# EAGLE design zb_pt4115_v1.1 (EAGLE 9.6.2)
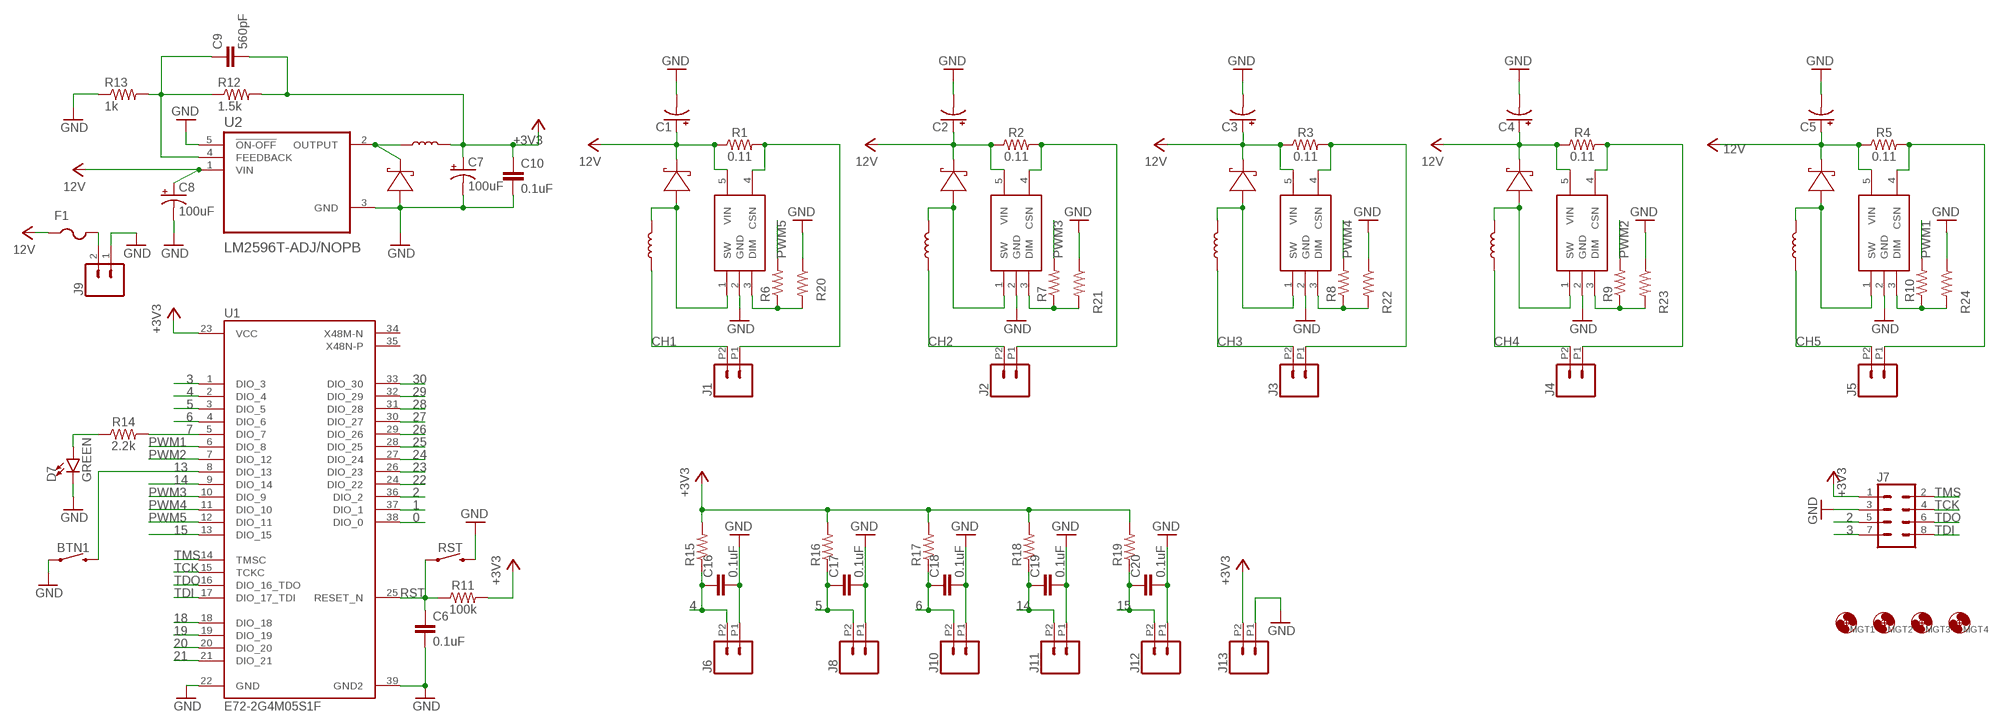
[diagram p0: schematic, sheet 1]

## Parts
BTN1  MOMENTARY-SWITCH-SPST-SMD-4.6X2.8MM  [TACTILE_SWITCH_SMD_4.6X2.8MM]
C1  100uF  100UF-POLAR-EIA7343-16V-10%(TANT)  [EIA7343]
C2  100uF  100UF-POLAR-EIA7343-16V-10%(TANT)  [EIA7343]
C3  100uF  100UF-POLAR-EIA7343-16V-10%(TANT)  [EIA7343]
C4  100uF  100UF-POLAR-EIA7343-16V-10%(TANT)  [EIA7343]
C5  100uF  100UF-POLAR-EIA7343-16V-10%(TANT)  [EIA7343]
C6  0.1uF  0.1UF-0603-100V-10%  [0603]
C7  100uF  100UF-POLAR-25V-20%(ELEC)  [PANASONIC_D]
C8  100uF  100UF-POLAR-25V-20%(ELEC)  [PANASONIC_D]
C9  560pF  560PF-0603-50V-5%  [0603]
C10  0.1uF  0.1UF-0603-25V-5%  [0603]
C16  0.1uF  0.1UF-0603-100V-10%  [0603]
C17  0.1uF  0.1UF-0603-100V-10%  [0603]
C18  0.1uF  0.1UF-0603-100V-10%  [0603]
C19  0.1uF  0.1UF-0603-100V-10%  [0603]
C20  0.1uF  0.1UF-0603-100V-10%  [0603]
D1  SS18  [DIOM5227X270N]
D2  SS18  [DIOM5227X270N]
D3  SS18  [DIOM5227X270N]
D4  SS18  [DIOM5227X270N]
D5  SS18  [DIOM5227X270N]
D6  SS18  [DIOM5227X270N]
D7  GREEN  LED-GREEN0603  [LED-0603]
F1  PTCFUSE-1812  [1812]
IC1  68uH  MSS1038-473MLB  [INDPM102100X400N]
IC2  68uH  MSS1038-473MLB  [INDPM102100X400N]
IC3  68uH  MSS1038-473MLB  [INDPM102100X400N]
IC4  68uH  MSS1038-473MLB  [INDPM102100X400N]
IC5  68uH  MSS1038-473MLB  [INDPM102100X400N]
IC6  68uH  MSS1038-473MLB  [INDPM102100X400N]
J1  CONN_022.54MM_SCREWTERM  [1X02_2.54_SCREWTERM]
J2  CONN_022.54MM_SCREWTERM  [1X02_2.54_SCREWTERM]
J3  CONN_022.54MM_SCREWTERM  [1X02_2.54_SCREWTERM]
J4  CONN_022.54MM_SCREWTERM  [1X02_2.54_SCREWTERM]
J5  CONN_022.54MM_SCREWTERM  [1X02_2.54_SCREWTERM]
J6  CONN_022.54MM_SCREWTERM  [1X02_2.54_SCREWTERM]
J7  CONN_04X2  [2X4]
J8  CONN_022.54MM_SCREWTERM  [1X02_2.54_SCREWTERM]
J9  CONN_025MM  [SCREWTERMINAL-5MM-2]
J10  CONN_022.54MM_SCREWTERM  [1X02_2.54_SCREWTERM]
J11  CONN_022.54MM_SCREWTERM  [1X02_2.54_SCREWTERM]
J12  CONN_022.54MM_SCREWTERM  [1X02_2.54_SCREWTERM]
J13  CONN_022.54MM_SCREWTERM  [1X02_2.54_SCREWTERM]
MGT1  MOUNT-HOLE3.0  [3,0]
MGT2  MOUNT-HOLE3.0  [3,0]
MGT3  MOUNT-HOLE3.0  [3,0]
MGT4  MOUNT-HOLE3.0  [3,0]
R1  0.11  0.11OHM-2010-1/2W-1%  [2010]
R2  0.11  0.11OHM-2010-1/2W-1%  [2010]
R3  0.11  0.11OHM-2010-1/2W-1%  [2010]
R4  0.11  0.11OHM-2010-1/2W-1%  [2010]
R5  0.11  0.11OHM-2010-1/2W-1%  [2010]
R6  100Ohm  R-US_R0805  [R0805]
R7  100Ohm  R-US_R0805  [R0805]
R8  100Ohm  R-US_R0805  [R0805]
R9  100Ohm  R-US_R0805  [R0805]
R10  100Ohm  R-US_R0805  [R0805]
R11  100k  100KOHM-0603-1/10W-1%  [0603]
R12  1.5k  R-US_R0805  [R0805]
R13  1k  R-US_R0805  [R0805]
R14  2.2k  2.2KOHM-0603-1/10W-1%  [0603]
R15  10k  R-US_R0805  [R0805]
R16  10k  R-US_R0805  [R0805]
R17  10k  R-US_R0805  [R0805]
R18  10k  R-US_R0805  [R0805]
R19  10k  R-US_R0805  [R0805]
R20  3k  R-US_R0805  [R0805]
R21  3k  R-US_R0805  [R0805]
R22  3k  R-US_R0805  [R0805]
R23  3k  R-US_R0805  [R0805]
R24  3k  R-US_R0805  [R0805]
RST  MOMENTARY-SWITCH-SPST-SMD-4.6X2.8MM  [TACTILE_SWITCH_SMD_4.6X2.8MM]
U1  E72-2G4M05S1F  [E72-2G4M05S1F]
U2  LM2596T-ADJ/NOPB  [TO170P1016X470X2092-5]
U$1  PT4115  [SOT-89-5]
U$2  PT4115  [SOT-89-5]
U$3  PT4115  [SOT-89-5]
U$4  PT4115  [SOT-89-5]
U$5  PT4115  [SOT-89-5]

## Nets
0: U1.38(DIO_0)
1: U1.37(DIO_1)
2: J7.5 U1.36(DIO_2)
3: J7.7 U1.1(DIO_3)
4: C16.1 J6.P2 R15.1 U1.2(DIO_4)
5: C17.1 J8.P2 R16.1 U1.3(DIO_5)
6: C18.1 J10.P2 R17.1 U1.4(DIO_6)
7: R14.2 U1.5(DIO_7)
13: BTN1.3 BTN1.4 U1.8(DIO_13)
14: C19.1 J11.P2 R18.1 U1.9(DIO_14)
15: C20.1 J12.P2 R19.1 U1.13(DIO_15)
18: U1.18(DIO_18)
19: U1.19(DIO_19)
20: U1.20(DIO_20)
21: U1.21(DIO_21)
22: U1.24(DIO_22)
23: U1.26(DIO_23)
24: U1.27(DIO_24)
25: U1.28(DIO_25)
26: U1.29(DIO_26)
27: U1.30(DIO_27)
28: U1.31(DIO_28)
29: U1.32(DIO_29)
30: U1.33(DIO_30)
+3V3: C7.+ C9.2 C10.1 IC6.2 J7.1 J13.P2 R11.2 R12.2 R15.2 R16.2 R17.2 R18.2 R19.2 U1.23(VCC)
CH1: IC1.1 J1.P2
CH2: IC2.1 J2.P2
CH3: IC3.1 J3.P2
CH4: IC4.1 J4.P2
CH5: IC5.1 J5.P2
GND: BTN1.1 BTN1.2 C1.C(-) C2.C(-) C3.C(-) C4.C(-) C5.C(-) C6.2 C7.- C8.- C10.2 C16.2 C17.2 C18.2 C19.2 C20.2 D6.2(A) D7.C J6.P1 J7.3 J8.P1 J9.1 J10.P1 J11.P1 J12.P1 J13.P1 R13.1 R20.1 R21.1 R22.1 R23.1 R24.1 RST.3 RST.4 U1.22(GND) U1.39(GND2) U2.3(GND) U2.5(!ON-OFF) U$1.2(GND) U$2.2(GND) U$3.2(GND) U$4.2(GND) U$5.2(GND)
N$1: D1.2(A) IC1.2 U$1.1(SW)
N$2: R6.1 R20.2 U$1.3(DIM)
N$3: C9.1 R12.1 R13.2 U2.4(FEEDBACK)
N$4: D2.2(A) IC2.2 U$2.1(SW)
N$5: J1.P1 R1.2 U$1.4(CSN)
N$6: J2.P1 R2.2 U$2.4(CSN)
N$7: R7.1 R21.2 U$2.3(DIM)
N$8: R8.1 R22.2 U$3.3(DIM)
N$9: D3.2(A) IC3.2 U$3.1(SW)
N$10: J3.P1 R3.2 U$3.4(CSN)
N$11: R9.1 R23.2 U$4.3(DIM)
N$12: R10.1 R24.2 U$5.3(DIM)
N$13: D4.2(A) IC4.2 U$4.1(SW)
N$14: J4.P1 R4.2 U$4.4(CSN)
N$15: D7.A R14.1
N$16: D6.1(K) IC6.1 U2.2(OUTPUT)
N$17: D5.2(A) IC5.2 U$5.1(SW)
N$18: J5.P1 R5.2 U$5.4(CSN)
PWM1: R10.2 U1.6(DIO_8)
PWM2: R9.2 U1.7(DIO_12)
PWM3: R7.2 U1.10(DIO_9)
PWM4: R8.2 U1.11(DIO_10)
PWM5: R6.2 U1.12(DIO_11)
RST: C6.1 R11.1 RST.1 RST.2 U1.25(RESET_N)
TCK: J7.4 U1.15(TCKC)
TDI: J7.8 U1.17(DIO_17_TDI)
TDO: J7.6 U1.16(DIO_16_TDO)
TMS: J7.2 U1.14(TMSC)
VCC: C1.A(+) C2.A(+) C3.A(+) C4.A(+) C5.A(+) C8.+ D1.1(K) D2.1(K) D3.1(K) D4.1(K) D5.1(K) F1.1 F1.2 J9.2 R1.1 R2.1 R3.1 R4.1 R5.1 U2.1(VIN) U$1.5(VIN) U$2.5(VIN) U$3.5(VIN) U$4.5(VIN) U$5.5(VIN) ; supply symbol labelled 12V
Unconnected: U1.34(X48M-N) U1.35(X48N-P)

## Library data of the parts
BTN1 RST = SparkFun-Switches:MOMENTARY-SWITCH-SPST: Momentary Switch (Pushbutton) - SPST Normally-open (NO) SPST momentary switches (buttons, pushbuttons). Variants PTH-12MM - 12mm square, through-hole Momentary Pushbutton Switch - 12mm Square <https://www.sparkfun.com/products/9190> (COM-09190) PTH-6.0MM, PTH-6.0MM-KIT - 6.0mm square, through-hole Mini Pushbutton Switch <https://www.sparkfun.com/products/97> (COM-00097) KIT package intended for soldering kit's - only one side of pads' copper is exposed. PTH-RIGHT-ANGLE-KIT - Right-angle, through-hole Right Angle Tactile Button <https://www.sparkfun.com/products/10791> - Used on SparkFun BigTime Watch Kit <https://www.sparkfun.com/products/11734> SMD-12MM - 12mm square, surface-mount Tactile Button - SMD (12mm) <https://www.sparkfun.com/products/12993> (COM-12993) Used on SparkFun PicoBoard <https://www.sparkfun.com/products/11888> SMD-4.5MM - 4.5mm Square Trackball Switch Used on SparkFun Blackberry Trackballer Breakout <https://www.sparkfun.com/products/13169> SMD-4.6MMX2.8MM - 4.60mm x 2.80mm, surface mount Used on SparkFun SAMD21 Mini Breakout <https://www.sparkfun.com/products/13664> SMD-5.2MM, SMD-5.2-REDUNDANT - 5.2mm square, surface-mount Mini Pushbutton Switch - SMD <https://www.sparkfun.com/products/8720> (COM-08720) Used on Arduino Pro Mini <https://www.sparkfun.com/products/11114> REDUNDANT package connects both switch circuits together SMD-6.0X3.5MM - 6.0 x 3.5mm, surface mount Momentary Reset Switch SMD <https://www.sparkfun.com/products/8229> (COM-08229) SMD-6.2MM-TALL - 6.2mm square, surface mount Tactile Button - SMD (6mm) <https://www.sparkfun.com/products/12992> Used on SparkFun Digital Sandbox <https://www.sparkfun.com/products/12651> SMD-RIGHT-ANGLE - Right-angle, surface mount Used on SparkFun Block for Intel® Edison - Arduino <https://www.sparkfun.com/products/13036>; PROD_ID: SWCH-13065
C1-C5 = SparkFun-Capacitors:100UF-POLAR: 100µF polarized capacitors A capacitor is a passive two-terminal electrical component used to store electrical energy temporarily in an electric field.; PROD_ID: CAP-08702
C6 C16-C20 = SparkFun-Capacitors:0.1UF: 0.1µF ceramic capacitors A capacitor is a passive two-terminal electrical component used to store electrical energy temporarily in an electric field.; PROD_ID: CAP-08390
C7 C8 = SparkFun-Capacitors:100UF-POLAR: 100µF polarized capacitors A capacitor is a passive two-terminal electrical component used to store electrical energy temporarily in an electric field.; PROD_ID: CAP-12547
C9 = SparkFun-Capacitors:560PF: 0.56nF/560pF ceramic capacitors A capacitor is a passive two-terminal electrical component used to store electrical energy temporarily in an electric field.; PROD_ID: CAP-08749
C10 = SparkFun-Capacitors:0.1UF: 0.1µF ceramic capacitors A capacitor is a passive two-terminal electrical component used to store electrical energy temporarily in an electric field.; PROD_ID: CAP-08604
D1-D6 = SS18:SS18: Schottky Diodes & Rectifiers 1a 80V Rectifier Schottky Barrier Source: Datasheet <https://componentsearchengine.com/Datasheets/2/SS18.pdf>; ARROW_PART_NUMBER: SS18; ARROW_PRICE-STOCK: https://www.arrow.com/en/products/ss18/on-semiconductor?region=nac; DESCRIPTION: Schottky Diodes & Rectifiers 1a 80V Rectifier Schottky Barrier; HEIGHT: 2.7mm; MANUFACTURER_NAME: ON Semiconductor; MANUFACTURER_PART_NUMBER: SS18; MOUSER_PART_NUMBER: 512-SS18; MOUSER_PRICE-STOCK: https://www.mouser.co.uk/ProductDetail/ON-Semiconductor-Fairchild/SS18?qs=mVVXn4M53U%252B25aMJheuSLA%3D%3D
D7 = SparkFun-LED:LED-GREEN: Green SMD LED Used in manufacturing of various products at SparkFun Packages: 0603 - SMD 0603 package [Product Link] <http://www.futureelectronics.com/en/technologies/semiconductors/optoelectronics/leds/Pages/9894312-LTST-C190GKT.aspx?CrossPart=HSMG-C190&IM=0> LilyPad 1206 - SMD1206 LilyPad package [Product Link] <http://www.futureelectronics.com/en/Technologies/Product.aspx?ProductID=IN150NGHARVATEKCORPORATION2049943&IM=0> 1206 - SMD1206 package [Product Link] <http://www.futureelectronics.com/en/technologies/semiconductors/optoelectronics/leds/Pages/8315665-LTST-C150KGKT.aspx?IM=0> 1206 Bottom Mount -SMD 1206 Bottom Mount [Product Link] <http://www.digikey.com/product-detail/en/lite-on-inc/LTST-C230KGKT/160-1456-1-ND/386854> SparkFun Products: Pro Mini 328 -5V <https://www.sparkfun.com/products/821> RedBoard <https://www.sparkfun.com/products/12757> MP3 Trigger <https://www.sparkfun.com/products/13720> Makey Makey <https://www.sparkfun.com/products/11076>; PROD_ID: DIO-00821
F1 = adafruit:PTCFUSE: PTC fuses, resettable thermistors
IC1-IC6 = MSS1038-473MLB:MSS1038-473MLB: Fixed Inductors MSS1038 SMT Shielded 47 uH 20 % 2.2 A Source: Datasheet <https://componentsearchengine.com/Datasheets/1/MSS1038-473MLB.pdf>; DESCRIPTION: Fixed Inductors MSS1038 SMT Shielded 47 uH 20 % 2.2 A; HEIGHT: 4mm; MANUFACTURER_NAME: COILCRAFT; MANUFACTURER_PART_NUMBER: MSS1038-473MLB; MOUSER_PART_NUMBER: 994-MSS1038-473MLB; MOUSER_PRICE-STOCK: https://www.mouser.co.uk/ProductDetail/Coilcraft/MSS1038-473MLB/?qs=VJjuEbE9QBN6EsaT8NREzg%3D%3D
J1-J6 J8 J10-J13 = SparkFun-Connectors:CONN_02: Multi connection point. Often used as Generic Header-pin footprint for 0.1 inch spaced/style header connections On any of the 0.1 inch spaced packages, you can populate with these: Break Away Headers - Straight <https://www.sparkfun.com/products/116> (PRT-00116) Break Away Male Headers - Right Angle <https://www.sparkfun.com/products/553> (PRT-00553) Female Headers <https://www.sparkfun.com/products/115> (PRT-00115) Break Away Headers - Machine Pin <https://www.sparkfun.com/products/117> (PRT-00117) Break Away Female Headers - Swiss Machine Pin <https://www.sparkfun.com/products/743> (PRT-00743) For SCREWTERMINALS and SPRING TERMINALS visit here: Screw Terimnals on SparkFun.com <https://www.sparkfun.com/search/results?term=Screw+Terminals> (5mm/3.5mm/2.54mm spacing) This device is also useful as a general connection point to wire up your design to another part of your project. Our various solder wires solder well into these plated through hole pads. Hook-Up Wire - Assortment (Stranded, 22 AWG) <https://www.sparkfun.com/products/11375> (PRT-11375) Hook-Up Wire - Assortment (Solid Core, 22 AWG) <https://www.sparkfun.com/products/11367> (PRT-11367) View the entire wire category on our website here <https://www.sparkfun.com/categories/141> Special notes: Molex polarized connector foot print use with: PRT-08233 with associated crimp pins and housings. 2.54_SCREWTERM for use with PRT-10571. 3.5mm Screw Terminal footprints for PRT-08084 5mm Screw Terminal footprints for use with PRT-08432
J7 = SparkFun-SEWPAD16:CONN_04X2: Multi connection point. Often used as Generic Header-pin footprint for 0.1 inch spaced/style header connections On any of the 0.1 inch spaced packages, you can populate with these: Break Away Headers - Straight <https://www.sparkfun.com/products/116> (PRT-00116) Break Away Male Headers - Right Angle <https://www.sparkfun.com/products/553> (PRT-00553) Female Headers <https://www.sparkfun.com/products/115> (PRT-00115) Break Away Headers - Machine Pin <https://www.sparkfun.com/products/117> (PRT-00117) Break Away Female Headers - Swiss Machine Pin <https://www.sparkfun.com/products/743> (PRT-00743)
J9 = SparkFun-SEWPAD16:CONN_02: Multi connection point. Often used as Generic Header-pin footprint for 0.1 inch spaced/style header connections On any of the 0.1 inch spaced packages, you can populate with these: Break Away Headers - Straight <https://www.sparkfun.com/products/116> (PRT-00116) Break Away Male Headers - Right Angle <https://www.sparkfun.com/products/553> (PRT-00553) Female Headers <https://www.sparkfun.com/products/115> (PRT-00115) Break Away Headers - Machine Pin <https://www.sparkfun.com/products/117> (PRT-00117) Break Away Female Headers - Swiss Machine Pin <https://www.sparkfun.com/products/743> (PRT-00743) For SCREWTERMINALS and SPRING TERMINALS visit here: Screw Terimnals on SparkFun.com <https://www.sparkfun.com/search/results?term=Screw+Terminals> (5mm/3.5mm/2.54mm spacing) This device is also useful as a general connection point to wire up your design to another part of your project. Our various solder wires solder well into these plated through hole pads. Hook-Up Wire - Assortment (Stranded, 22 AWG) <https://www.sparkfun.com/products/11375> (PRT-11375) Hook-Up Wire - Assortment (Solid Core, 22 AWG) <https://www.sparkfun.com/products/11367> (PRT-11367) View the entire wire category on our website here <https://www.sparkfun.com/categories/141> Special notes: Molex polarized connector foot print use with: PRT-08233 with associated crimp pins and housings. 2.54_SCREWTERM for use with PRT-10571. 3.5mm Screw Terminal footprints for PRT-08084 5mm Screw Terminal footprints for use with PRT-08432; SF_SKU: PRT-08432
MGT1-MGT4 = holes:MOUNT-HOLE: MOUNTING HOLE with drill center marker
R1-R5 = SparkFun-Resistors:0.11OHM: 0.11Ω resistor A resistor is a passive two-terminal electrical component that implements electrical resistance as a circuit element. Resistors act to reduce current flow, and, at the same time, act to lower voltage levels within circuits. - Wikipedia; PROD_ID: RES-08354
R6-R10 R12 R13 R15-R24 = adafruit:R-US_: RESISTOR, American symbol
R11 = SparkFun-Resistors:100KOHM: 100kΩ resistor A resistor is a passive two-terminal electrical component that implements electrical resistance as a circuit element. Resistors act to reduce current flow, and, at the same time, act to lower voltage levels within circuits. - Wikipedia; PROD_ID: RES-07828
R14 = SparkFun-Resistors:2.2KOHM: 2.2kΩ resistor A resistor is a passive two-terminal electrical component that implements electrical resistance as a circuit element. Resistors act to reduce current flow, and, at the same time, act to lower voltage levels within circuits. - Wikipedia; PROD_ID: RES-08272
U1 = E72-2G4M05S1F:E72-2G4M05S1F
U2 = LM2596T-ADJ_NOPB:LM2596T-ADJ/NOPB: Check prices <https://pricing.snapeda.com/parts/LM2596T-ADJ/NOPB/Texas%20Instruments/view-part?ref=eda>; AVAILABILITY: In Stock; DESCRIPTION: SIMPLE SWITCHER&reg; 4.5V to 40V, 3A Low Component Count Step-Down Regulator 5-TO-220 -40 to 125; MF: Texas Instruments; MP: LM2596T-ADJ/NOPB; PACKAGE: TO-220-5 Texas Instruments; PRICE: None; PURCHASE-URL: https://pricing.snapeda.com/search/part/LM2596T-ADJ/NOPB/?ref=eda
U$1-U$5 = PT4115:PT4115: 30V, 1.2A Step-down HIgh Brightness LED Driver with 5000:1 Dimming Check prices <https://pricing.snapeda.com/parts/PT4115/Pulse/view-part?ref=eda>; AVAILABILITY: Not in stock; MF: Pulse; MP: PT4115; PACKAGE: None; PRICE: None

## Board
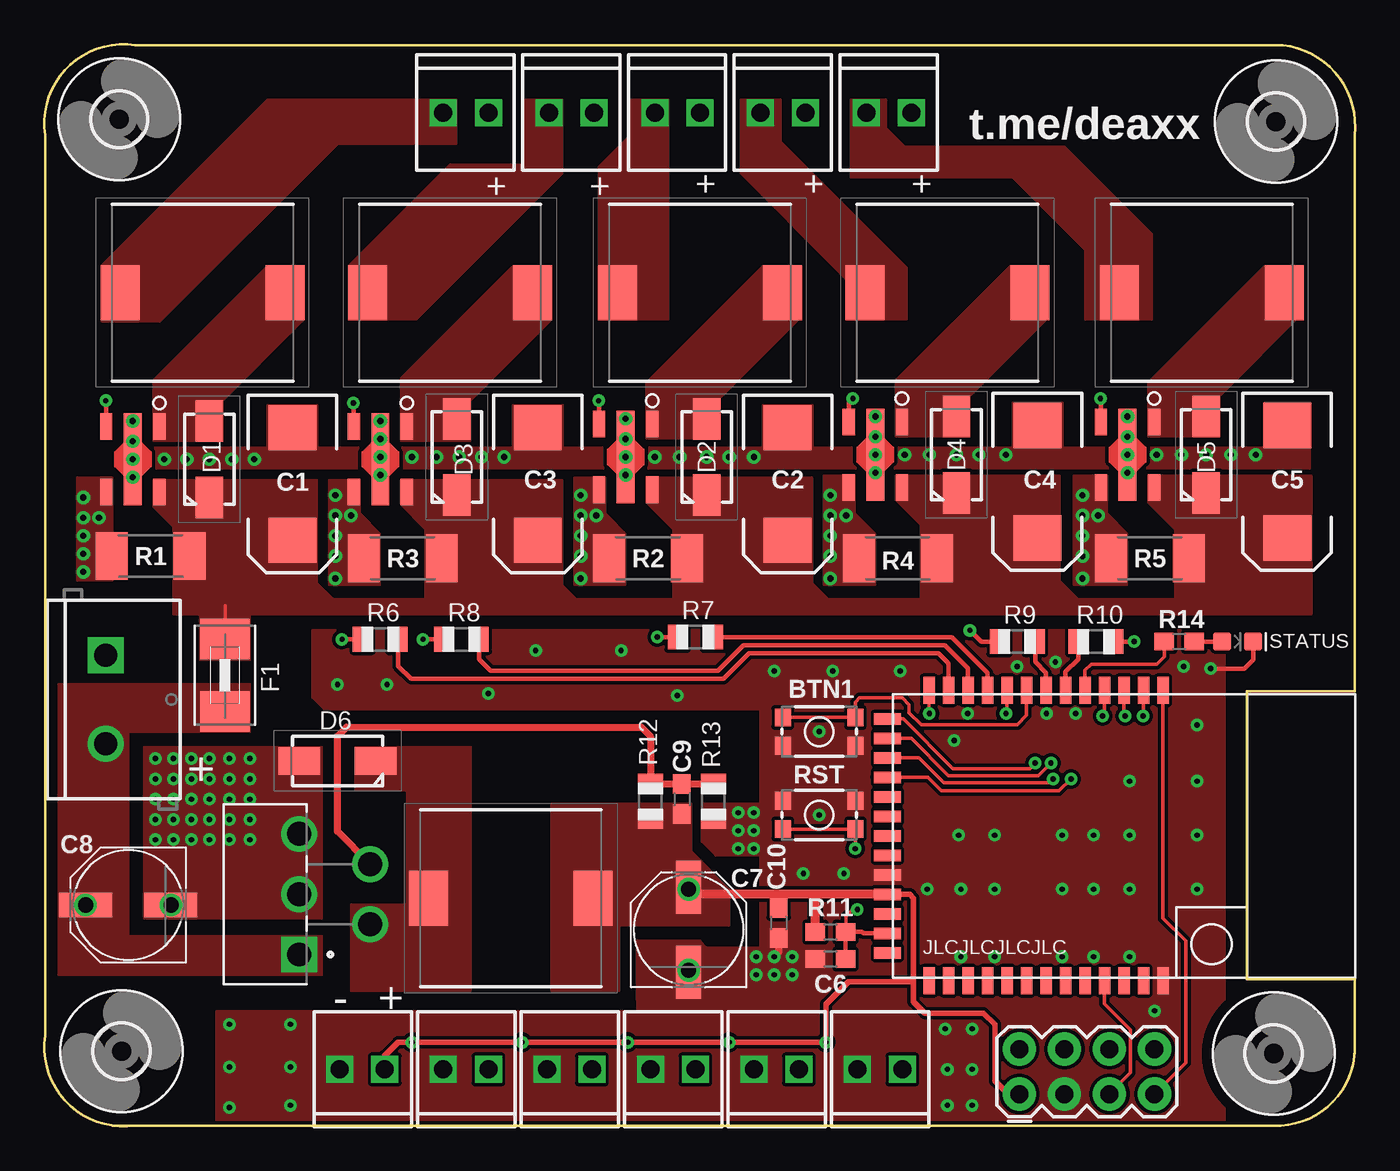
[diagram p1: board, top side]
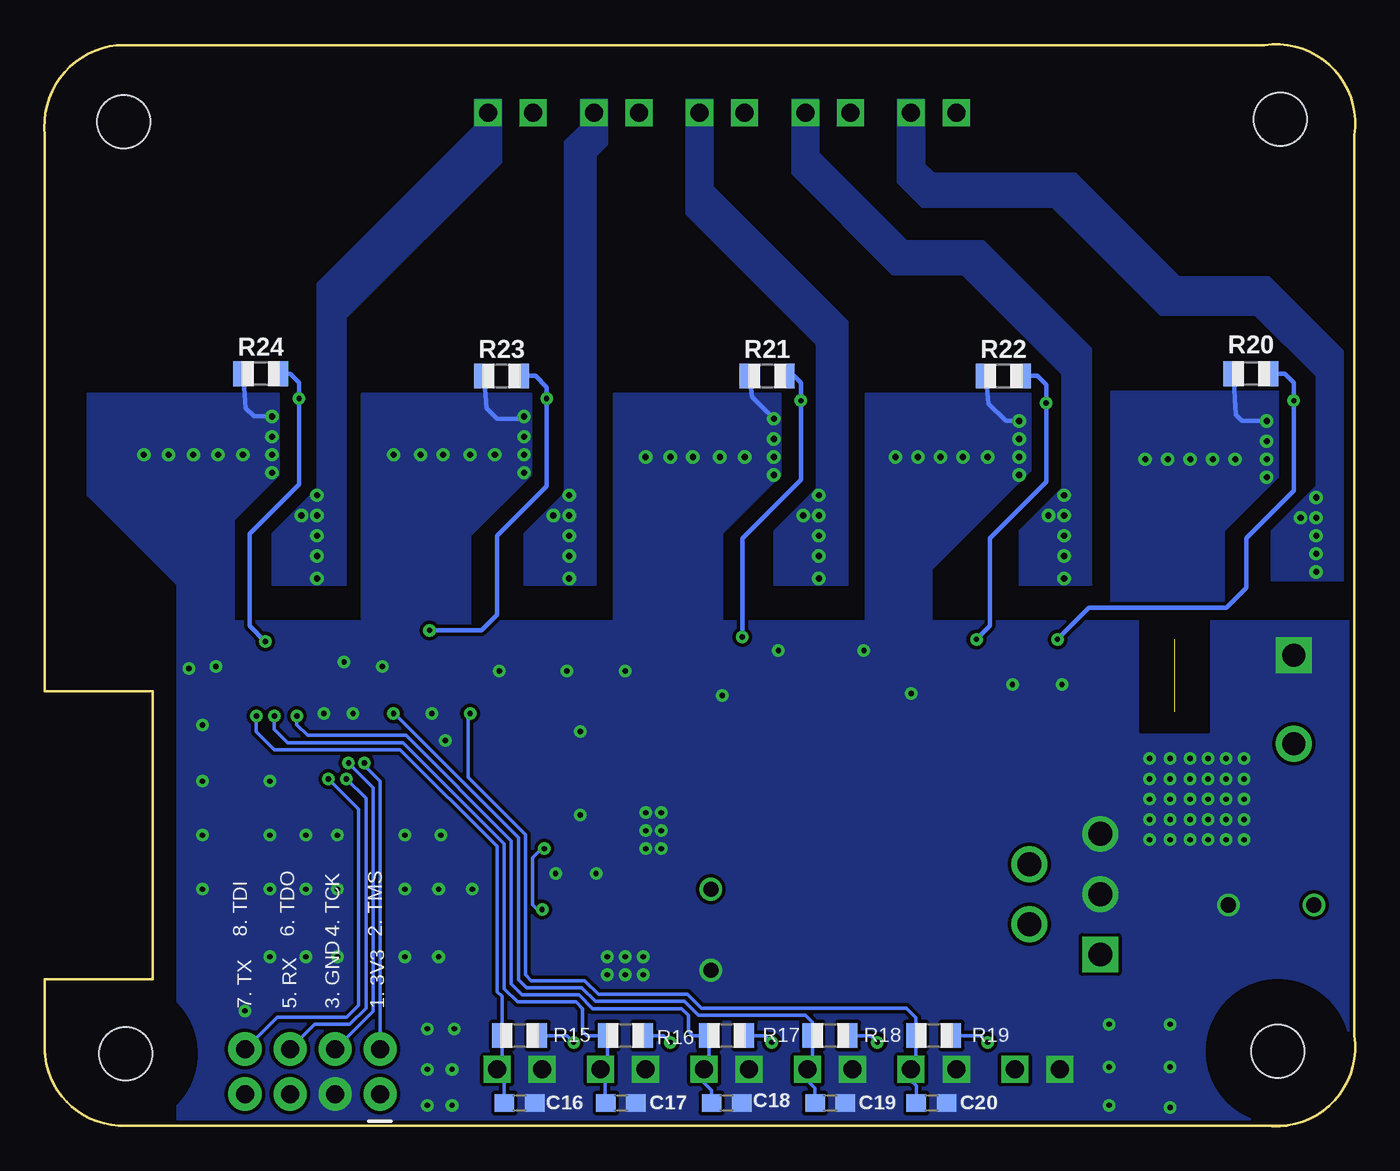
[diagram p2: board, bottom side, seen from below]

Size 73.98 x 61.04 mm. Coordinates in mm from the lower left corner, seen from the top.
Outline: 5.12,0.04 3.85,0.04
Outline: 5.12,0.04 arc-106 0.04,5.12 0.04,55.92 arc-106 5.12,61 69.89,61 arc-90 73.95,55.92 73.95,24.55 67.86,24.55 67.86,8.3 73.95,8.3 73.95,4.36
Outline: 5.12,0.04 69.38,0.04
Outline: 69.38,0.04 69.76,0.04
Outline: 73.95,4.36 73.95,4.1
Outline: 73.95,4.36 arc-92 69.38,0.04
Copper layers (1*16): Top 0.035mm / dielectric 1.5mm / Bottom 0.035mm
Design rules "default *": minimum track width 0.2mm, minimum drill 0.2mm, track to track 0.2mm, track to pad 6mil, pad to pad 6mil, via to via 6mil, smd to smd 6mil, copper to edge 0.2mm, drill to drill 0.3mm, minimum pad ring 10mil, minimum via ring 8mil, stop-mask expansion 4mil, vias tented up to drill 0.35mm, thermal gap 10mil
bRestrict: area 8.3,22.3 to 12.1,28.6

### Footprints (pad centres in the part's own frame; a part is rotated, then mirrored left to right if it is on the bottom)
TACTILE_SWITCH_SMD_4.6X2.8MM = smd 0.9 x 1: 1 -2.05,-0.8; 2 2.05,-0.8; 3 2.05,0.8; 4 -2.05,0.8
EIA7343 = smd 2.55 x 2.7: A 3.17,0; C -3.17,0
0603 = smd 1.1 x 1: 1 -0.85,0; 2 0.85,0
PANASONIC_D = smd 3 x 1.4: + 2.4,0; - -2.4,0
DIOM5227X270N = smd 2.35 x 1.55: 1 -2.15,0; 2 2.15,0
LED-0603 = smd 1 x 1: A -0.877,0; C 0.877,0
1812 = smd 2.286 x 2.794: 1 -2.046,0; 2 2.046,0
INDPM102100X400N = smd 2.2 x 3.1: 1 -4.65,0; 2 4.65,0
1X02_2.54_SCREWTERM = drill 1.016 square: P1 2.54,0; P2 0,0
2X4 = drill 1.016 pad 1.88: 1 -3.81,-1.27; 2 -3.81,1.27; 3 -1.27,-1.27; 4 -1.27,1.27; 5 1.27,-1.27; 6 1.27,1.27; 7 3.81,-1.27; 8 3.81,1.27
SCREWTERMINAL-5MM-2 = drill 1.3 pad 2.032 square: 1 0,0 | drill 1.3 pad 2.032: 2 5,0
3,0 = hole 3: 0,0
2010 = smd 1.8 x 2.7: 1 -2.2,0; 2 2.2,0
R0805 = smd 1.1 x 1.4: 1 -1,0; 2 1,0
E72-2G4M05S1F = smd 1.5 x 0.65: 1 -8.43,3.15; 2 -8.43,2.05; 3 -8.43,0.95; 4 -8.43,-0.15; 5 -8.43,-1.25; 6 -8.43,-2.35; 7 -8.43,-3.45; 8 -8.43,-4.55; 9 -8.43,-5.65; 10 -8.43,-6.75; 11 -8.43,-7.85; 12 -8.43,-8.95; 13 -8.43,-10.05; 27 7.96,-10.05; 28 7.96,-8.95; 29 7.96,-7.85; 30 7.96,-6.75; 31 7.96,-5.65; 32 7.96,-4.55; 33 7.96,-3.45; 34 7.96,-2.35; 35 7.96,-1.25; 36 7.96,-0.15; 37 7.96,0.95; 38 7.96,2.05; 39 7.96,3.15 | smd 0.65 x 1.5: 14 -6.81,-12.4; 15 -5.71,-12.4; 16 -4.61,-12.4; 17 -3.51,-12.4; 18 -2.41,-12.4; 19 -1.31,-12.4; 20 -0.21,-12.4; 21 0.89,-12.4; 22 1.99,-12.4; 23 3.09,-12.4; 24 4.19,-12.4; 25 5.29,-12.4; 26 6.39,-12.4
TO170P1016X470X2092-5 = drill 1.35 square: 1 0,0 | drill 1.35: 2 1.7,-4; 3 3.4,0; 4 5.1,-4; 5 6.8,0
SOT-89-5 = smd 0.7 x 1.5: 1 -1.5,-1.85; 3 1.5,-1.85; 4 1.5,1.85; 5 -1.5,1.85 | smd 1 x 5.2: 2 0,0

### Placement (x,y rotation side)
BTN1  43.73,22.27 0 top
C1  14.01,36.24 270 top
C2  41.95,36.24 270 top
C3  27.85,36.24 270 top
C4  56.05,36.36 270 top
C5  70.14,36.36 270 top
C6  44.36,9.44 180 top
C7  36.36,11.09 90 top
C8  4.74,12.49 180 top
C9  35.98,18.46 270 top
C10  41.44,11.47 270 top
C16  47.16,1.31 0 bottom
C17  41.44,1.31 0 bottom
C18  35.47,1.31 0 bottom
C19  29.63,1.31 0 bottom
C20  23.92,1.31 0 bottom
D1  9.31,37.63 90 top
D2  37.38,37.76 90 top
D3  23.28,37.76 90 top
D4  51.48,37.89 90 top
D5  65.57,37.89 90 top
D6  16.55,20.61 180 top
D7  67.35,27.35 0 top
F1  10.2,25.44 270 top
IC1  8.93,47.03 0 top
IC2  37,47.03 0 top
IC3  22.9,47.03 0 top
IC4  50.97,47.03 0 top
IC5  65.32,47.03 0 top
IC6  26.33,12.87 0 top
J1  22.52,57.19 0 top
J2  34.46,57.19 0 top
J3  28.49,57.19 0 top
J4  40.43,57.19 0 top
J5  46.4,57.19 0 top
J6  48.43,3.22 180 top
J7  58.84,3.09 0 top
J8  42.59,3.22 180 top
J9  3.47,26.58 270 top
J10  36.74,3.22 180 top
J11  30.9,3.22 180 top
J12  25.06,3.22 180 top
J13  19.22,3.22 180 top
MGT1  4.36,4.23 0 top
MGT2  69.38,4.1 0 top
MGT3  4.23,56.81 0 top
MGT4  69.51,56.68 0 top
R1  6.01,32.17 180 top
R2  34.08,32.04 180 top
R3  20.23,32.04 180 top
R4  48.17,32.04 180 top
R5  62.4,32.04 180 top
R6  18.96,27.47 0 top
R7  36.74,27.6 0 top
R8  23.54,27.47 0 top
R9  54.9,27.35 0 top
R10  59.35,27.35 180 top
R11  44.36,10.96 180 top
R12  34.2,18.33 270 top
R13  37.76,18.33 90 top
R14  64.05,27.35 180 top
R15  47.16,5.12 0 bottom
R16  41.19,5.12 0 bottom
R17  35.47,5.12 0 bottom
R18  29.63,5.12 0 bottom
R19  23.79,5.12 0 bottom
R20  5.88,42.46 0 bottom
R21  33.19,42.33 0 bottom
R22  19.85,42.33 0 bottom
R23  48.17,42.33 0 bottom
R24  61.76,42.46 0 bottom
RST  43.73,17.57 0 top
U1  59.98,16.17 270 top
U2  14.39,9.69 90 top
U$1  4.99,37.63 180 top
U$2  32.81,37.76 180 top
U$3  18.96,37.63 180 top
U$4  46.9,37.89 180 top
U$5  61.13,37.89 180 top

### Tracks (layer width: path | path; a pad name or v marks a point on that pad's centre or on a via)
2
  Top 0.2: U1.36 59.83,6.92 61.3,5.45 61.3,3.01 J7.5
3
  Top 0.2: U1.1 63.13,11.75 64.43,10.45 64.43,3.6 J7.7
4  (via drill 0.3)
  Top 0.2: U1.2 62.03,23.17 v62.02,23.15
  Bottom 0.2: v62.02,23.15 62.02,22.27 61,21.25 53.89,21.25 48.43,15.79 48.43,7.6 48.16,7.33 R15.1 48.16,3.49 J6.P2 48.05,2.83 48.05,1.35 C16.1
5  (via drill 0.3)
  Top 0.2: U1.3 60.93,23.22 v61,23.15
  Bottom 0.2: v61,23.15 61,22.41 60.24,21.65 53.72,21.65 48.03,15.95 48.03,7.77 47.28,7.03 43.98,7.03 43.6,6.64 43.6,5.37 43.35,5.12 R16.1 42.19,3.61 J8.P2 42.59,3.09 42.33,2.83 42.33,1.35 C17.1
6  (via drill 0.3)
  Top 0.2: U1.4 59.83,23.26 v59.73,23.15
  Bottom 0.2: v59.73,23.15 59.73,22.65 59.13,22.05 53.56,22.05 47.63,16.12 47.63,8.04 47.01,7.43 43.82,7.43 43.04,6.64 38.01,6.64 37.63,6.26 37.63,5.37 37.38,5.12 R17.1 36.47,3.49 J10.P2 36.74,2.45 36.32,2.03 C18.1
7
  Top 0.203: U1.5 58.73,25.71 59.1,26.08 62.78,26.08 63.2,26.5 R14.2
13
  Top 0.2: U1.8 55.43,23.18 54.9,22.65 49.5,22.65 48.81,23.34 48.81,23.79 48.43,24.17 46.01,24.17 45.78,23.93 BTN1.3 BTN1.4
14  (via drill 0.3)
  Top 0.2: U1.9 54.33,23.35 v54.27,23.28
  Bottom 0.2: v54.27,23.28 54.22,23.28 47.23,16.29 47.23,8.28 46.78,7.83 43.65,7.83 42.87,7.04 37.85,7.04 37.07,6.26 31.03,6.26 30.63,5.87 R18.1 30.63,3.49 J11.P2 30.9,2.58 30.48,2.16 C19.1
15  (via drill 0.3)
  Top 0.2: U1.13 49.93,23.3 v49.95,23.28
  Bottom 0.2: v49.95,23.28 50.08,23.15 50.08,19.7 46.83,16.45 46.83,8.55 46.5,8.23 43.49,8.23 42.7,7.44 37.68,7.44 36.9,6.66 25.33,6.66 24.79,6.12 R19.1 24.79,3.49 J12.P2 25.06,2.58 24.77,2.29 C20.1
+3V3  (via drill 0.3, 0.85)
  Top 0.305: J13.P2 19.22,3.98 19.98,4.74 v20.74,4.74 v26.96,4.74 v32.93,4.74 v38.65,4.74 v44.11,4.74 44.11,6.9 45.38,8.17 49.06,8.17 | U1.23 48.85,13.08 49.06,12.87 49.06,8.17 | 49.06,8.17 49.06,7.03 49.7,6.39 53,6.39 53.63,5.76 53.63,2.58 54.4,1.82 J7.1
  Top 0.406: C10.1 41.44,13.08
  Top 0.508: U1.23 43.6,13.08 | 43.6,13.08 41.44,13.08 36.66,13.08 v36.36,13.38 | R11.2 43.51,12.99 43.6,13.08
  Bottom 0.2: R19.2 21.12,5.12 v20.74,4.74 | R18.2 27.35,5.12 v26.96,4.74 | R17.2 33.31,5.12 v32.93,4.74 | R16.2 39.03,5.12 v38.65,4.74 | R15.2 44.49,5.12 v44.11,4.74
  pour Top (no thermals): 32.43,7.66 28.62,7.66 28.62,18.2 36.49,18.2 36.49,15.53 38.65,13.38 38.65,11.34 32.43,11.34
CH1
  pour Top (no thermals): 6.52,45.38 3.22,45.38 3.22,48.55 12.61,57.95 23.28,57.95 23.28,55.41 16.55,55.41
CH2
  pour Top (no thermals): 35.22,45.51 31.28,45.51 31.28,54.14 32.93,55.79 32.93,57.95 35.22,57.95
CH3
  pour Top (no thermals): 21,45.51 17.19,45.51 17.19,48.55 22.9,54.27 27.09,54.27 27.09,57.95 29.25,57.95 29.25,53.76
CH4
  pour Top (no thermals): 48.68,45.51 45.25,45.51 45.25,47.79 39.28,53.76 39.28,57.95 41.57,57.95 41.57,55.54 48.68,48.43
CH5
  pour Top (no thermals): 62.52,45.51 58.71,45.51 58.71,49.44 54.65,53.51 45.51,53.51 45.51,57.95 47.54,57.95 47.54,56.3 48.55,55.29 57.57,55.29 62.52,50.33
GND  (via drill 0.3, 0.35, 0.85, 0.85 pad 0.55)
  Top 0.254: D7.C 68.23,26.32 67.73,25.82 v65.83,25.82
  Top 0.406: C10.2 41.44,9.82 v41.19,9.57
  Bottom 0.254: R22.1 20.7,40.77 19.73,39.79 v18.96,39.79 | R21.1 34.04,41.15 v32.81,39.92 | R23.1 49.02,40.51 48.43,39.92 47.03,39.92 v46.9,40.05 | R24.1 62.61,40.51 62.14,40.05 v61.13,40.05 | R20.1 6.73,40.13 6.39,39.79 v4.99,39.79
  other vias: 4.99,37.63 9.31,37.63 18.96,37.76 23.41,37.76 32.81,37.76 37.38,37.76 51.48,37.89 61.13,37.89 65.57,37.89 46.9,37.89 10.58,37.63 11.85,37.63 8.04,37.63 6.77,37.63 20.74,37.76 22.14,37.76 24.68,37.76 25.95,37.76 34.46,37.76 35.85,37.76 38.65,37.76 40.05,37.76 48.55,37.89 49.95,37.89 52.75,37.89 54.27,37.89 62.78,37.89 64.18,37.89 66.97,37.89 68.37,37.89 4.99,38.65 18.96,38.78 32.81,38.78 46.9,38.9 61.13,38.9 36.36,8.8 7.15,12.49 6.26,20.74 7.28,20.74 8.3,20.74 9.31,20.74 10.45,20.74 11.6,20.74 6.26,19.6 6.26,18.46 6.26,17.31 6.26,16.17 40.17,9.57 40.17,8.55 41.19,8.55 39.16,17.69 39.16,16.68 39.16,15.66 7.28,16.17 7.28,17.31 7.28,18.46 7.28,19.6 8.3,19.6 9.31,19.6 10.45,19.6 11.6,19.6 8.3,18.46 9.31,18.46 10.45,18.46 11.6,18.46 8.3,17.31 9.31,17.31 10.45,17.31 11.6,17.31 8.3,16.17 9.31,16.17 10.45,16.17 11.6,16.17 65.06,22.65 65.06,19.47 65.06,16.42 65.06,13.38 40.05,17.69 40.05,16.68 40.05,15.66 27.73,26.84 32.55,26.84 16.55,24.93 19.34,24.93 25.06,24.42 35.73,24.3 62.65,6.52 4.99,36.62 18.96,36.74 32.81,36.74 46.9,36.87 61.13,36.87 61.25,13.38 57.44,13.38 61.25,16.42 57.44,16.42 52.11,23.28 53.63,13.38 49.82,13.38 53.63,16.42 53.63,9.57 57.44,9.57 61.25,9.57 52.36,3.22 42.2,8.55 42.2,9.57 56.56,23.28 58.21,23.28 59.22,9.57 51.73,9.57 51.73,13.38 51.6,16.42 59.22,13.38 59.22,16.42 61.25,19.47 10.45,5.76 10.45,1.06 10.45,3.34 52.36,5.5 52.36,1.18 50.84,5.5 50.97,3.22 50.97,1.18 51.35,21.76 13.88,5.76 13.88,3.34 13.88,1.18 42.84,14.26 45.13,14.26 43.73,17.57 43.73,22.27 41.19,25.69 44.49,25.69 48.3,25.69 54.9,25.95 57.06,26.2 64.3,25.95
  pour Top (no thermals): 3.98,38.27 3.98,37.12 71.41,37.12 71.41,40.81 68.87,40.81 68.87,38.27 57.44,38.27 57.44,40.81 54.65,40.81 54.65,38.27 43.35,38.27 43.35,40.68 40.55,40.68 40.55,38.27 29.25,38.27 29.25,40.68 26.46,40.68 26.46,38.27 15.41,38.27 15.41,40.68 12.61,40.68 12.61,38.27
  pour Top (no thermals): 5.63,11.72 15.66,11.72 15.66,21.38 5.63,21.38
  pour Bottom (no thermals): -0.59,28.49 66.46,28.49 66.46,-0.34 -0.59,-0.34
  pour Top (no thermals): 33.44,10.45 33.44,7.15 43.98,7.15 43.98,10.07 37.38,10.07 37,10.45
  pour Top (no thermals): 37.12,18.2 37.12,16.04 37.89,15.28 40.68,15.28 40.68,18.2
  pour Bottom (no thermals): 18.33,41.32 18.33,37 23.92,31.41 23.92,28.11 27.6,28.11 27.6,41.32
  pour Bottom (no thermals): 32.43,41.32 32.43,36.74 35.73,33.44 35.73,28.11 41.82,28.11 41.82,41.32
  pour Bottom (no thermals): 46.52,41.32 46.52,36.74 49.95,33.31 49.95,28.36 56.05,28.36 56.05,41.32
  pour Bottom (no thermals): 60.75,41.32 60.75,36.74 63.29,34.2 63.29,28.23 66.46,28.23 66.46,30.52 71.54,35.6 71.54,41.32
  pour Top (no thermals): 15.15,27.98 15.15,24.17 15.79,23.54 40.43,23.54 40.43,-0.21 66.59,-0.21 66.59,27.98
  pour Top (no thermals): 41.32,0.29 9.69,0.29 9.69,6.52 33.44,6.52 33.44,8.3 41.32,8.3
  pour Bottom (no thermals): 4.36,41.44 13.76,41.44 13.76,28.23 8.42,28.23 7.41,29.25 7.41,33.57 4.36,36.62
N$1
  pour Top (no thermals): 10.07,38.65 6.14,38.65 6.14,42.08 12.61,48.55 14.65,48.55 14.65,45.51 10.07,40.93
N$2  (via drill 0.3)
  Top 0.254: R6.1 v16.8,27.47 | U$1.3 3.49,40.91 v3.47,40.93
  Bottom 0.254: R20.2 3.98,42.46 3.47,41.95 v3.47,40.93 3.47,35.85 6.14,33.19 6.14,30.39 7.28,29.25 15.03,29.25 v16.8,27.47
N$3
  Top 0.406: U2.4 16.55,16.63 16.55,22.01 17.06,22.52 33.7,22.52 34.2,22.01 R12.1 35.96,19.33 C9.1 36,19.33 R13.2
N$4
  pour Top (no thermals): 38.14,38.78 33.95,38.78 33.95,41.95 40.55,48.55 42.71,48.55 42.71,45.63 38.14,41.06
N$5  (via drill 0.35)
  other vias: 2.2,31.28 2.2,32.3 2.2,33.31 2.2,34.33 2.2,35.47 3.09,34.33
  pour Top (no thermals): 3.85,30.77 1.82,30.77 1.82,36.62 3.85,36.62
  pour Bottom (no thermals): 24.3,57.95 24.3,54.27 23.79,53.76 15.79,53.76 9.95,47.92 4.87,47.92 0.68,43.73 0.68,30.77 4.74,30.77 4.74,33.57 2.2,36.11 2.2,42.33 5.63,45.76 10.96,45.76 17.06,51.86 24.42,51.86 25.82,53.25 25.82,57.95
N$6  (via drill 0.35)
  other vias: 30.27,30.9 30.27,33.31 30.27,32.17 30.27,34.46 30.27,35.6 31.16,34.46
  pour Top (no thermals): 32.81,30.52 29.89,30.52 29.89,36.62 31.66,36.62 31.66,34.58 32.81,33.44
  pour Bottom (no thermals): 32.81,30.52 28.62,30.52 28.62,45.38 36.24,53 36.24,57.95 37.76,57.95 37.76,51.48 30.39,44.11 30.39,35.98 32.81,33.57
  pour Bottom: 28.62,45.38 28.62,30.52 32.81,30.52 32.81,33.57 30.39,35.98 30.39,44.11 37.76,51.48 37.76,57.95 36.24,57.95 36.24,53
N$7  (via drill 0.3)
  Top 0.254: R7.1 v34.58,27.6 | U$2.3 31.31,40.91 v31.28,40.93
  Bottom 0.254: v34.58,27.6 34.58,33.19 31.28,36.49 v31.28,40.93 31.28,41.95 31.66,42.33 R21.2
N$8  (via drill 0.3)
  Top 0.254: R8.1 v21.38,27.47 | U$3.3 17.46,40.78 v17.44,40.81
  Bottom 0.254: v21.38,27.47 20.61,28.23 20.61,33.19 17.44,36.36 v17.44,40.81 17.44,41.82 17.95,42.33 R22.2
N$9
  pour Top (no thermals): 24.04,38.65 20.11,38.65 20.11,42.2 26.46,48.55 28.62,48.55 28.62,45.51 24.04,40.93
N$10  (via drill 0.35)
  other vias: 16.42,30.9 16.42,33.31 16.42,32.17 16.42,34.46 16.42,35.6 17.31,34.46
  pour Top (no thermals): 18.96,30.52 16.04,30.52 16.04,36.49 17.82,36.49 17.82,34.58 18.96,33.44
  pour Bottom (no thermals): 30.27,57.95 30.27,54.9 25.31,49.95 21,49.95 14.9,43.86 14.9,30.52 18.96,30.52 18.96,33.57 16.55,35.98 16.55,42.46 22.14,48.05 26.08,48.05 31.79,53.76 31.79,57.95
N$11  (via drill 0.3)
  Top 0.254: R9.1 52.87,27.35 v52.24,27.98 | U$4.3 45.4,40.83 v45.63,41.06
  Bottom 0.254: R23.2 46.27,42.33 45.63,41.7 v45.63,41.06 45.63,36.11 48.43,33.31 48.43,28.87 49.32,27.98 v52.24,27.98
N$12  (via drill 0.3)
  Top 0.254: R10.1 v61.51,27.35 | U$5.3 59.63,41.04 v59.6,41.06
  Bottom 0.254: v61.51,27.35 62.4,28.23 62.4,33.44 59.6,36.24 v59.6,41.06 59.6,41.95 60.11,42.46 R24.2
N$13
  pour Top (no thermals): 52.24,38.9 48.05,38.9 48.05,42.08 54.52,48.55 56.68,48.55 56.68,45.63 52.24,41.19
N$14  (via drill 0.35)
  other vias: 44.36,30.9 44.36,33.31 44.36,32.17 44.36,34.46 44.36,35.6 45.25,34.46
  pour Top (no thermals): 46.9,30.52 43.98,30.52 43.98,36.74 45.76,36.74 45.76,34.58 46.9,33.44
  pour Bottom (no thermals): 46.9,30.52 43.47,30.52 43.47,54.14 42.2,55.41 42.2,57.95 43.73,57.95 43.73,56.43 44.62,55.54 44.62,35.73 46.9,33.44
  pour Bottom: 42.2,57.95 42.2,55.41 42.84,54.78 42.84,30.52 46.9,30.52 46.9,33.44 44.62,35.73 44.62,55.54 43.73,56.43 43.73,57.95
N$15
  Top 0.254: 65.05,27.5 R14.1 D7.A
N$16
  pour Top (no thermals): 17.31,12.49 17.31,7.66 24.04,7.66 24.04,21.38 17.57,21.38 17.57,18.96 20.49,18.96 20.49,12.49
N$17
  pour Top (no thermals): 66.33,38.9 62.27,38.9 62.27,41.95 68.87,48.55 71.03,48.55 71.03,45.89 66.33,41.19
N$18  (via drill 0.35)
  other vias: 58.59,30.9 58.59,33.31 58.59,32.17 58.59,34.46 58.59,35.6 59.48,34.46
  pour Top (no thermals): 61.13,30.52 58.08,30.52 58.08,36.74 59.98,36.74 59.98,34.58 61.13,33.44
  pour Bottom (no thermals): 61.13,30.52 56.94,30.52 56.94,45.63 48.17,54.4 48.17,57.95 49.7,57.95 49.7,56.43 58.59,47.54 58.59,35.98 61.13,33.44
  pour Bottom: 56.94,45.63 48.17,54.4 48.17,57.95 49.7,57.95 49.7,56.43 58.59,47.54 58.59,35.98 61.13,33.44 61.13,30.52 56.94,30.52
PWM1
  Top 0.254: U1.6 57.63,25.63 58.35,26.35 R10.2
PWM2
  Top 0.254: R9.2 55.92,27.33 55.92,26.2 56.53,25.59 U1.7
PWM3
  Top 0.254: R7.2 51.22,27.6 53.23,25.59 U1.10
PWM4
  Top 0.254: U1.11 52.13,25.85 50.84,27.15 39.46,27.15 38.01,25.69 25.19,25.69 24.54,26.35 R8.2
PWM5
  Top 0.254: U1.12 51.03,26.12 50.46,26.69 39.78,26.69 38.33,25.24 20.69,25.24 19.96,25.96 R6.2
RST  (via drill 0.3)
  Top 0.2: R11.1 45.25,11 45.25,11.85 45.63,12.23 v45.89,12.23 | RST.1 RST.2 45.78,15.68 v45.76,15.66
  Top 0.254: U1.25 46.22,10.88 46.14,10.96 R11.1 C6.1
  Bottom 0.2: v45.76,15.66 45.92,15.66 46.43,15.15 46.43,12.49 46.17,12.23 v45.89,12.23
TCK  (via drill 0.3)
  Top 0.2: 48.31,21.88 U1.15 48.94,21.88 51.04,19.78 56.1,19.78 v56.81,20.49
  Bottom 0.2: J7.4 55.43,6.5 55.43,19.11 v56.81,20.49
TDI  (via drill 0.3)
  Top 0.2: 46.9,19.68 U1.17 49.87,19.68 50.63,18.92 57.27,18.92 v57.95,19.6
  Bottom 0.2: J7.8 60.85,6.16 56.91,6.16 56.23,6.83 56.23,17.88 v57.95,19.6
TDO  (via drill 0.3)
  Top 0.2: U1.16 49.36,20.78 50.76,19.38 56.72,19.38 v56.94,19.6
  Bottom 0.2: J7.6 58.71,5.76 56.74,5.76 55.83,6.66 55.83,18.49 v56.94,19.6
TMS  (via drill 0.3)
  Top 0.2: U1.14 48.48,22.98 51.27,20.18 55.62,20.18 v55.92,20.49
  Bottom 0.2: v55.92,20.49 55.92,20.36 55.03,19.47 J7.2
VCC  (via drill 0.85)  (1 unrouted)
  Top 0.2: 10.2,29.38 F1.1
  other vias: 2.33,12.49
  pour Top (no thermals): 7.28,28.87 7.28,33.82 6.14,34.97 6.14,36.49 15.41,36.49 15.41,30.65 16.3,29.76 21.5,29.76 21.5,33.7 20.11,35.09 20.11,36.49 29.25,36.49 29.25,30.52 30.01,29.76 35.47,29.76 35.47,33.7 33.95,35.22 33.95,36.62 43.35,36.62 43.35,30.65 44.24,29.76 49.44,29.76 49.44,33.95 48.05,35.35 48.05,36.74 57.32,36.74 57.32,30.77 58.33,29.76 63.79,29.76 63.79,33.7 62.27,35.22 62.27,36.74 71.54,36.74 71.54,28.87
  pour Top (no thermals): 11.6,24.93 0.8,24.93 0.8,8.55 15.66,8.55 15.66,10.71 4.74,10.71 4.74,22.27 11.6,22.27
  pour Top (no thermals): 11.6,26.33 8.8,26.33 8.8,29.12 11.6,29.12

### Text on the board
tNames: t.me/deaxx | + | + | + | + | + | STATUS | + | JLCJLCJLCJLC | - | +
bNames: 2. TMS | 4. TCK | 6. TDO | 8. TDI | 1. 3V3 | 3. GND | 5. RX | 7. TX